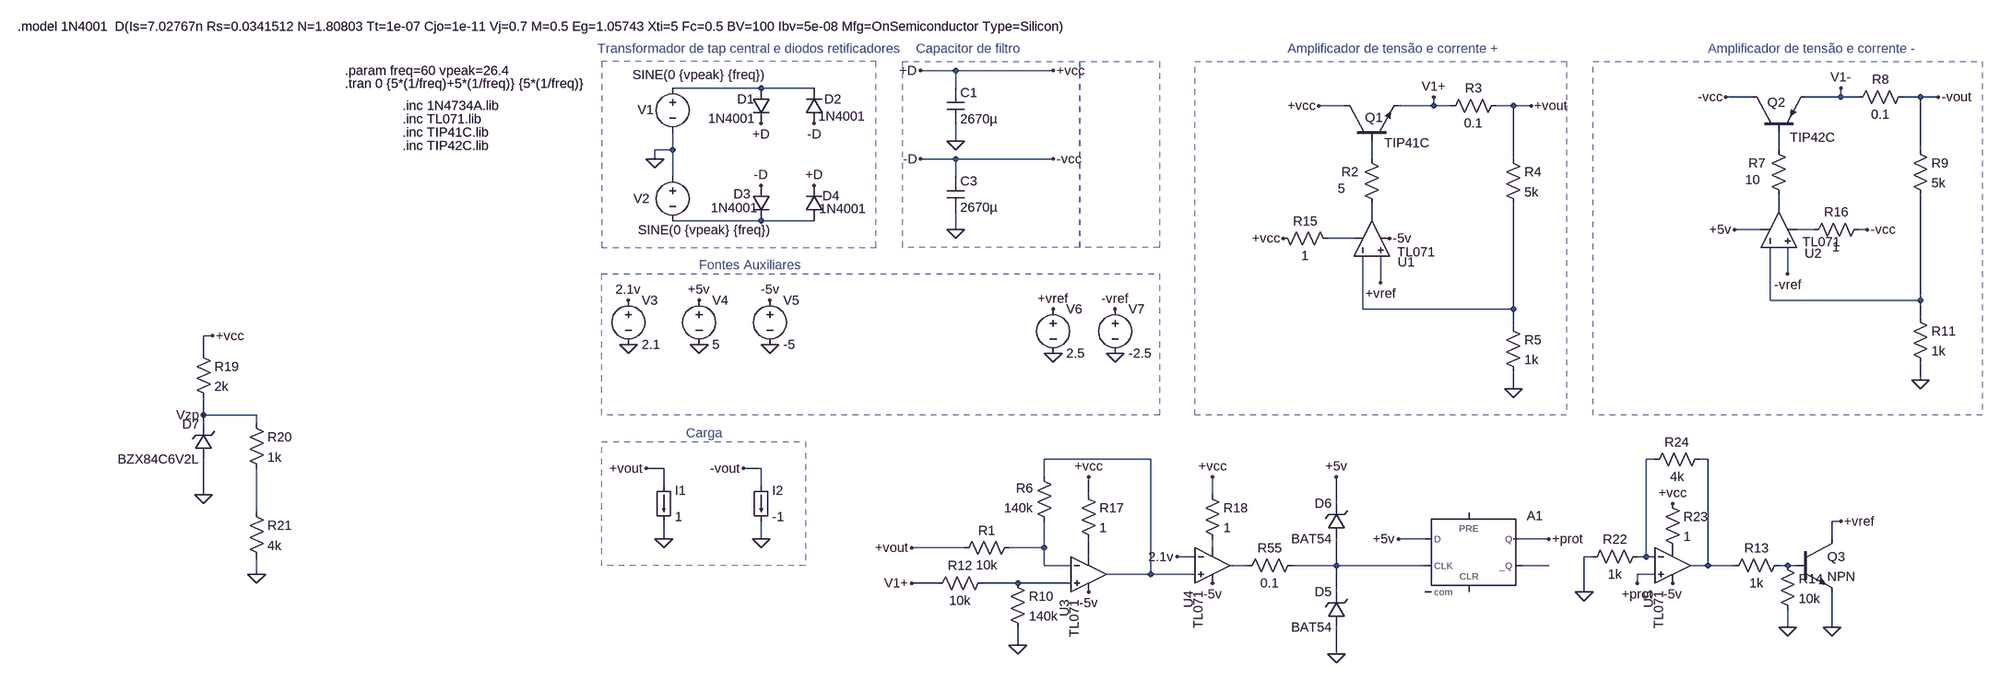
[diagram p0: schematic fonte_blocos.asc]
fonte_blocos.asc, the LTspice schematic file:
Version 4.1
SHEET 1 2812 1096
WIRE 768 16 704 16
WIRE 944 16 768 16
WIRE 416 48 256 48
WIRE 512 48 416 48
WIRE 768 48 768 16
WIRE 2208 64 2160 64
WIRE 2368 64 2368 48
WIRE 2368 64 2304 64
WIRE 2400 64 2368 64
WIRE 2512 64 2480 64
WIRE 2544 64 2512 64
WIRE 1472 80 1424 80
WIRE 1632 80 1632 64
WIRE 1632 80 1568 80
WIRE 1664 80 1632 80
WIRE 1776 80 1744 80
WIRE 1808 80 1776 80
WIRE 768 144 768 112
WIRE 256 160 256 128
WIRE 256 160 224 160
WIRE 2256 160 2256 128
WIRE 2512 160 2512 64
WIRE 224 176 224 160
WIRE 768 176 704 176
WIRE 944 176 768 176
WIRE 1520 176 1520 144
WIRE 1776 176 1776 80
WIRE 256 208 256 160
WIRE 768 208 768 176
WIRE 2256 272 2256 240
WIRE 416 288 256 288
WIRE 512 288 416 288
WIRE 1520 288 1520 256
WIRE 768 304 768 272
WIRE 2224 304 2176 304
WIRE 2320 304 2288 304
WIRE 2416 304 2400 304
WIRE 1488 320 1440 320
WIRE 2272 384 2272 336
WIRE 1536 400 1536 352
WIRE 2240 432 2240 336
WIRE 2512 432 2512 240
WIRE 2512 432 2240 432
WIRE 1504 448 1504 352
WIRE 1776 448 1776 256
WIRE 1776 448 1504 448
WIRE 2512 464 2512 432
WIRE 1776 480 1776 448
WIRE -576 496 -592 496
WIRE -592 528 -592 496
WIRE 2512 576 2512 544
WIRE 1776 592 1776 560
WIRE -592 640 -592 608
WIRE -496 640 -592 640
WIRE -592 656 -592 640
WIRE -496 656 -496 640
WIRE 1120 720 928 720
WIRE 2032 720 2016 720
WIRE 2128 720 2112 720
WIRE 240 736 208 736
WIRE 416 736 384 736
WIRE 928 752 928 720
WIRE 240 768 240 736
WIRE 416 768 416 736
WIRE -592 784 -592 720
WIRE 1008 784 1008 752
WIRE 1232 784 1232 752
WIRE 1456 800 1456 752
WIRE -496 816 -496 736
WIRE 2368 832 2352 832
WIRE 240 864 240 832
WIRE 416 864 416 832
WIRE 1616 864 1568 864
WIRE 1840 864 1776 864
WIRE 2352 864 2352 832
WIRE 784 880 688 880
WIRE 928 880 928 832
WIRE 928 880 864 880
WIRE 1232 880 1232 864
WIRE 1008 896 1008 864
WIRE 1200 896 1168 896
WIRE 1920 896 1904 896
WIRE 2016 896 2016 720
WIRE 2016 896 2000 896
WIRE 2032 896 2016 896
WIRE 928 912 928 880
WIRE 976 912 928 912
WIRE 1296 912 1264 912
WIRE 1456 912 1456 864
WIRE 1456 912 1376 912
WIRE 1616 912 1456 912
WIRE 1840 912 1792 912
WIRE 2128 912 2128 720
WIRE 2128 912 2096 912
WIRE 2176 912 2128 912
WIRE 2272 912 2256 912
WIRE 2288 912 2272 912
WIRE -496 928 -496 896
WIRE 1120 928 1120 720
WIRE 1120 928 1040 928
WIRE 1200 928 1120 928
WIRE 2032 928 2000 928
WIRE 736 944 688 944
WIRE 880 944 816 944
WIRE 976 944 880 944
WIRE 2000 944 2000 928
WIRE 1456 960 1456 912
WIRE 1904 960 1904 896
WIRE 2272 1024 2272 992
WIRE 2352 1024 2352 960
WIRE 880 1056 880 1024
WIRE 1456 1072 1456 1024
FLAG 416 112 +D
FLAG 512 224 +D
FLAG 416 224 -D
FLAG 512 112 -D
FLAG 704 16 +D
FLAG 768 144 0
FLAG 704 176 -D
FLAG 768 304 0
FLAG 944 16 +vcc
FLAG 944 176 -vcc
FLAG 224 176 0
FLAG 240 864 0
FLAG 208 736 +vout
FLAG 176 512 0
FLAG 304 512 0
FLAG 432 512 0
FLAG 176 432 2.1v
FLAG 304 432 +5v
FLAG 432 432 -5v
FLAG 944 448 +vref
FLAG 944 528 0
FLAG 1424 80 +vcc
FLAG 1536 400 +vref
FLAG 1632 64 V1+
FLAG 1808 80 +vout
FLAG 1776 592 0
FLAG 1360 320 +vcc
FLAG 1552 320 -5v
FLAG 1056 448 -vref
FLAG 1056 528 0
FLAG 2160 64 -vcc
FLAG 2272 384 -vref
FLAG 2368 48 V1-
FLAG 2544 64 -vout
FLAG 2512 576 0
FLAG 2176 304 +5v
FLAG 2416 304 -vcc
FLAG 416 864 0
FLAG 384 736 -vout
FLAG 880 1056 0
FLAG 688 944 V1+
FLAG 688 880 +vout
FLAG 1008 752 +vcc
FLAG 1008 960 -5v
FLAG 1168 896 2.1v
FLAG 1232 752 +vcc
FLAG 1232 944 -5v
FLAG 1568 864 +5v
FLAG 1456 752 +5v
FLAG 1456 1072 0
FLAG 1840 864 +prot
FLAG 2352 1024 0
FLAG 2368 832 +vref
FLAG 2272 1024 0
FLAG -592 784 0
FLAG -576 496 +vcc
FLAG -592 640 Vzp
FLAG -496 928 0
FLAG 1904 960 0
FLAG 2064 800 +vcc
FLAG 2064 944 -5v
FLAG 2000 944 +prot
SYMBOL diode 400 48 R0
WINDOW 0 -27 20 Left 2
WINDOW 3 -80 55 Left 2
SYMATTR InstName D1
SYMATTR Value 1N4001
SYMBOL diode 528 112 R180
WINDOW 0 -33 44 Left 2
WINDOW 3 -76 13 Left 2
SYMATTR InstName D2
SYMATTR Value 1N4001
SYMBOL diode 400 224 R0
WINDOW 0 -34 16 Left 2
WINDOW 3 -75 41 Left 2
SYMATTR InstName D3
SYMATTR Value 1N4001
SYMBOL diode 528 288 R180
WINDOW 0 -30 45 Left 2
WINDOW 3 -78 22 Left 2
SYMATTR InstName D4
SYMATTR Value 1N4001
SYMBOL cap 752 48 R0
SYMATTR InstName C1
SYMATTR Value 2670µ
SYMBOL cap 752 208 R0
SYMATTR InstName C3
SYMATTR Value 2670µ
SYMBOL voltage 256 32 R0
WINDOW 0 -63 55 Left 2
WINDOW 3 -72 -8 Left 2
WINDOW 123 0 0 Left 0
WINDOW 39 0 0 Left 0
SYMATTR InstName V1
SYMATTR Value SINE(0 {vpeak} {freq})
SYMBOL voltage 256 192 R0
WINDOW 0 -71 56 Left 2
WINDOW 3 -62 113 Left 2
WINDOW 123 0 0 Left 0
WINDOW 39 0 0 Left 0
SYMATTR InstName V2
SYMATTR Value SINE(0 {vpeak} {freq})
SYMBOL voltage 176 416 R0
WINDOW 123 0 0 Left 0
WINDOW 39 0 0 Left 0
SYMATTR InstName V3
SYMATTR Value 2.1
SYMBOL voltage 304 416 R0
WINDOW 123 0 0 Left 0
WINDOW 39 0 0 Left 0
SYMATTR InstName V4
SYMATTR Value 5
SYMBOL voltage 432 416 R0
WINDOW 123 0 0 Left 0
WINDOW 39 0 0 Left 0
SYMATTR InstName V5
SYMATTR Value -5
SYMBOL voltage 944 432 R0
WINDOW 123 0 0 Left 0
WINDOW 39 0 0 Left 0
SYMATTR InstName V6
SYMATTR Value 2.5
SYMBOL npn 1472 144 R270
WINDOW 0 43 36 VRight 2
WINDOW 3 -3 71 VRight 2
SYMATTR InstName Q1
SYMATTR Value TIP41C
SYMBOL OpAmps\\opamp2 1456 320 R270
WINDOW 0 -43 111 VRight 2
WINDOW 3 -25 110 VRight 2
SYMATTR InstName U1
SYMATTR Value TL071
SYMBOL res 1504 160 R0
WINDOW 0 -39 40 Left 2
WINDOW 3 -45 70 Left 2
SYMATTR InstName R2
SYMATTR Value 5
SYMBOL res 1760 64 R90
WINDOW 0 0 56 VBottom 2
WINDOW 3 32 56 VTop 2
SYMATTR InstName R3
SYMATTR Value 0.1
SYMBOL res 1760 160 R0
SYMATTR InstName R4
SYMATTR Value 5k
SYMBOL res 1760 464 R0
SYMATTR InstName R5
SYMATTR Value 1k
SYMBOL voltage 1056 432 R0
WINDOW 123 0 0 Left 0
WINDOW 39 0 0 Left 0
SYMATTR InstName V7
SYMATTR Value -2.5
SYMBOL OpAmps\\opamp2 2192 304 R270
WINDOW 0 -43 111 VRight 2
WINDOW 3 -22 107 VRight 2
SYMATTR InstName U2
SYMATTR Value TL071
SYMBOL res 2240 144 R0
WINDOW 0 -39 40 Left 2
WINDOW 3 -45 70 Left 2
SYMATTR InstName R7
SYMATTR Value 10
SYMBOL res 2496 48 R90
WINDOW 0 0 56 VBottom 2
WINDOW 3 32 56 VTop 2
SYMATTR InstName R8
SYMATTR Value 0.1
SYMBOL res 2496 144 R0
SYMATTR InstName R9
SYMATTR Value 5k
SYMBOL res 2496 448 R0
SYMATTR InstName R11
SYMATTR Value 1k
SYMBOL pnp 2208 128 R270
WINDOW 0 54 27 VRight 2
WINDOW 3 -9 68 VRight 2
SYMATTR InstName Q2
SYMATTR Value TIP42C
SYMBOL load 400 768 R0
WINDOW 123 0 0 Left 0
WINDOW 39 0 0 Left 0
SYMATTR InstName I2
SYMATTR Value -1
SYMBOL OpAmps\\opamp2 1008 864 R0
WINDOW 0 -43 111 VRight 2
WINDOW 3 -25 110 VRight 2
SYMATTR InstName U3
SYMATTR Value TL071
SYMBOL res 880 864 R90
WINDOW 0 0 56 VBottom 2
WINDOW 3 32 56 VTop 2
SYMATTR InstName R1
SYMATTR Value 10k
SYMBOL res 944 848 R180
WINDOW 0 36 76 Left 2
WINDOW 3 36 40 Left 2
SYMATTR InstName R6
SYMATTR Value 140k
SYMBOL res 864 928 R0
SYMATTR InstName R10
SYMATTR Value 140k
SYMBOL res 832 928 R90
WINDOW 0 0 56 VBottom 2
WINDOW 3 32 56 VTop 2
SYMATTR InstName R12
SYMATTR Value 10k
SYMBOL OpAmps\\opamp2 1232 848 R0
WINDOW 0 -43 111 VRight 2
WINDOW 3 -25 110 VRight 2
SYMATTR InstName U4
SYMATTR Value TL071
SYMBOL res 1392 896 R90
WINDOW 0 0 56 VBottom 2
WINDOW 3 32 56 VTop 2
SYMATTR InstName R55
SYMATTR Value 0.1
SYMBOL Digital\\dflop 1696 816 R0
SYMATTR InstName A1
SYMBOL zener 1472 1024 R180
WINDOW 0 24 64 Left 2
WINDOW 3 24 0 Left 2
SYMATTR InstName D5
SYMATTR Value BAT54
SYMBOL zener 1472 864 R180
WINDOW 0 24 64 Left 2
WINDOW 3 24 0 Left 2
SYMATTR InstName D6
SYMATTR Value BAT54
SYMBOL npn 2288 864 R0
SYMATTR InstName Q3
SYMBOL res 2272 896 R90
WINDOW 0 0 56 VBottom 2
WINDOW 3 32 56 VTop 2
SYMATTR InstName R13
SYMATTR Value 1k
SYMBOL res 2256 896 R0
SYMATTR InstName R14
SYMATTR Value 10k
SYMBOL res 1344 304 M90
WINDOW 0 0 56 VBottom 2
WINDOW 3 32 56 VTop 2
SYMATTR InstName R15
SYMATTR Value 1
SYMBOL res 2416 288 R90
WINDOW 0 0 56 VBottom 2
WINDOW 3 32 56 VTop 2
SYMATTR InstName R16
SYMATTR Value 1
SYMBOL res 992 768 R0
SYMATTR InstName R17
SYMATTR Value 1
SYMBOL res 1216 768 R0
SYMATTR InstName R18
SYMATTR Value 1
SYMBOL res -608 512 R0
SYMATTR InstName R19
SYMATTR Value 2k
SYMBOL zener -576 720 R180
WINDOW 0 24 64 Left 2
WINDOW 3 24 0 Left 2
SYMATTR InstName D7
SYMATTR Value BZX84C6V2L
SYMBOL load 224 768 R0
WINDOW 123 0 0 Left 0
WINDOW 39 0 0 Left 0
SYMATTR InstName I1
SYMATTR Value 1
SYMBOL res -512 640 R0
SYMATTR InstName R20
SYMATTR Value 1k
SYMBOL res -512 800 R0
SYMATTR InstName R21
SYMATTR Value 4k
SYMBOL OpAmps\\opamp2 2064 848 R0
WINDOW 0 -43 111 VRight 2
WINDOW 3 -25 110 VRight 2
SYMATTR InstName U5
SYMATTR Value TL071
SYMBOL res 2016 880 R90
WINDOW 0 0 56 VBottom 2
WINDOW 3 32 56 VTop 2
SYMATTR InstName R22
SYMATTR Value 1k
SYMBOL res 2048 784 R0
SYMATTR InstName R23
SYMATTR Value 1
SYMBOL res 2128 704 R90
WINDOW 0 0 56 VBottom 2
WINDOW 3 32 56 VTop 2
SYMATTR InstName R24
SYMATTR Value 4k
TEXT -336 40 Left 2 !.tran 0 {5*(1/freq)+5*(1/freq)} {5*(1/freq)}
TEXT -336 16 Left 2 !.param freq=60 vpeak=26.4
TEXT 120 -24 Left 2 ;Transformador de tap central e diodos retificadores
TEXT 696 -24 Left 2 ;Capacitor de filtro
TEXT -232 104 Left 2 !.inc TL071.lib
TEXT -232 80 Left 2 !.inc 1N4734A.lib
TEXT -232 128 Left 2 !.inc TIP41C.lib
TEXT -928 -64 Left 2 !.model 1N4001  D(Is=7.02767n Rs=0.0341512 N=1.80803 Tt=1e-07 Cjo=1e-11 Vj=0.7 M=0.5 Eg=1.05743 Xti=5 Fc=0.5 BV=100 Ibv=5e-08 Mfg=OnSemiconductor Type=Silicon)
TEXT 304 368 Left 2 ;Fontes Auxiliares
TEXT -232 152 Left 2 !.inc TIP42C.lib
TEXT 1368 -24 Left 2 ;Amplificador de tensão e corrente +
TEXT 2128 -24 Left 2 ;Amplificador de tensão e corrente -
TEXT 280 672 Left 2 ;Carga
RECTANGLE Normal 128 336 624 0 1
RECTANGLE Normal 992 336 672 0 1
RECTANGLE Normal 1136 336 992 0 1
RECTANGLE Normal 1136 640 128 384 1
RECTANGLE Normal 1872 640 1200 0 1
RECTANGLE Normal 2624 640 1920 0 1
RECTANGLE Normal 496 912 128 688 1

The netlist it stands for:
* fonte_blocos.asc
D1 N001 +vcc 1N4001
D2 -vcc N001 1N4001
D3 -vcc N005 1N4001
D4 N005 +vcc 1N4001
C1 +vcc 0 2670µ
C3 -vcc 0 2670µ
V1 N001 0 SINE(0 {vpeak} {freq})
V2 0 N005 SINE(0 {vpeak} {freq})
V3 2.1v 0 2.1
V4 +5v 0 5
V5 -5v 0 -5
V6 +vref 0 2.5
Q1 +vcc N003 V1+ 0 TIP41C
X§U1 +vref N010 N008 -5v N006 TL071  ; pins In+ In- V+ V- OUT
R2 N003 N006 5
R3 +vout V1+ 0.1
R4 +vout N010 5k
R5 N010 0 1k
V7 -vref 0 -2.5
X§U2 -vref N009 +5v N007 N004 TL071  ; pins In+ In- V+ V- OUT
R7 N002 N004 10
R8 -vout V1- 0.1
R9 -vout N009 5k
R11 N009 0 1k
Q2 -vcc N002 V1- 0 TIP42C
I2 -vout 0 -1
X§U3 N022 N015 N017 -5v N011 TL071  ; pins In+ In- V+ V- OUT
R1 N015 +vout 10k
R6 N015 N011 140k
R10 N022 0 140k
R12 N022 V1+ 10k
X§U4 N011 2.1v N016 -5v N018 TL071  ; pins In+ In- V+ V- OUT
R55 N019 N018 0.1
A1 +5v 0 N019 0 0 N020 +prot 0 DFLOP
D5 0 N019 BAT54
D6 N019 +5v BAT54
Q3 +vref N021 0 0 NPN
R13 N021 N013 1k
R14 N021 0 10k
R15 +vcc N008 1
R16 -vcc N007 1
R17 +vcc N017 1
R18 +vcc N016 1
R19 +vcc Vzp 2k
D7 0 Vzp BZX84C6V2L
I1 +vout 0 1
R20 Vzp N014 1k
R21 N014 0 4k
X§U5 +prot N012 P001 -5v N013 TL071  ; pins In+ In- V+ V- OUT
R22 N012 0 1k
R23 +vcc P001 1
R24 N013 N012 4k
.model D D
.lib standard.dio
.model NPN NPN
.model PNP PNP
.lib standard.bjt
.tran 0 {5*(1/freq)+5*(1/freq)} {5*(1/freq)}
.param freq=60 vpeak=26.4
* Transformador de tap central e diodos retificadores
* Capacitor de filtro
.inc TL071.lib
.inc 1N4734A.lib
.inc TIP41C.lib
.model 1N4001  D(Is=7.02767n Rs=0.0341512 N=1.80803 Tt=1e-07 Cjo=1e-11 Vj=0.7 M=0.5 Eg=1.05743 Xti=5 Fc=0.5 BV=100 Ibv=5e-08 Mfg=OnSemiconductor Type=Silicon)
* Fontes Auxiliares
.inc TIP42C.lib
* Amplificador de tensão e corrente +
* Amplificador de tensão e corrente -
* Carga
.backanno
.end